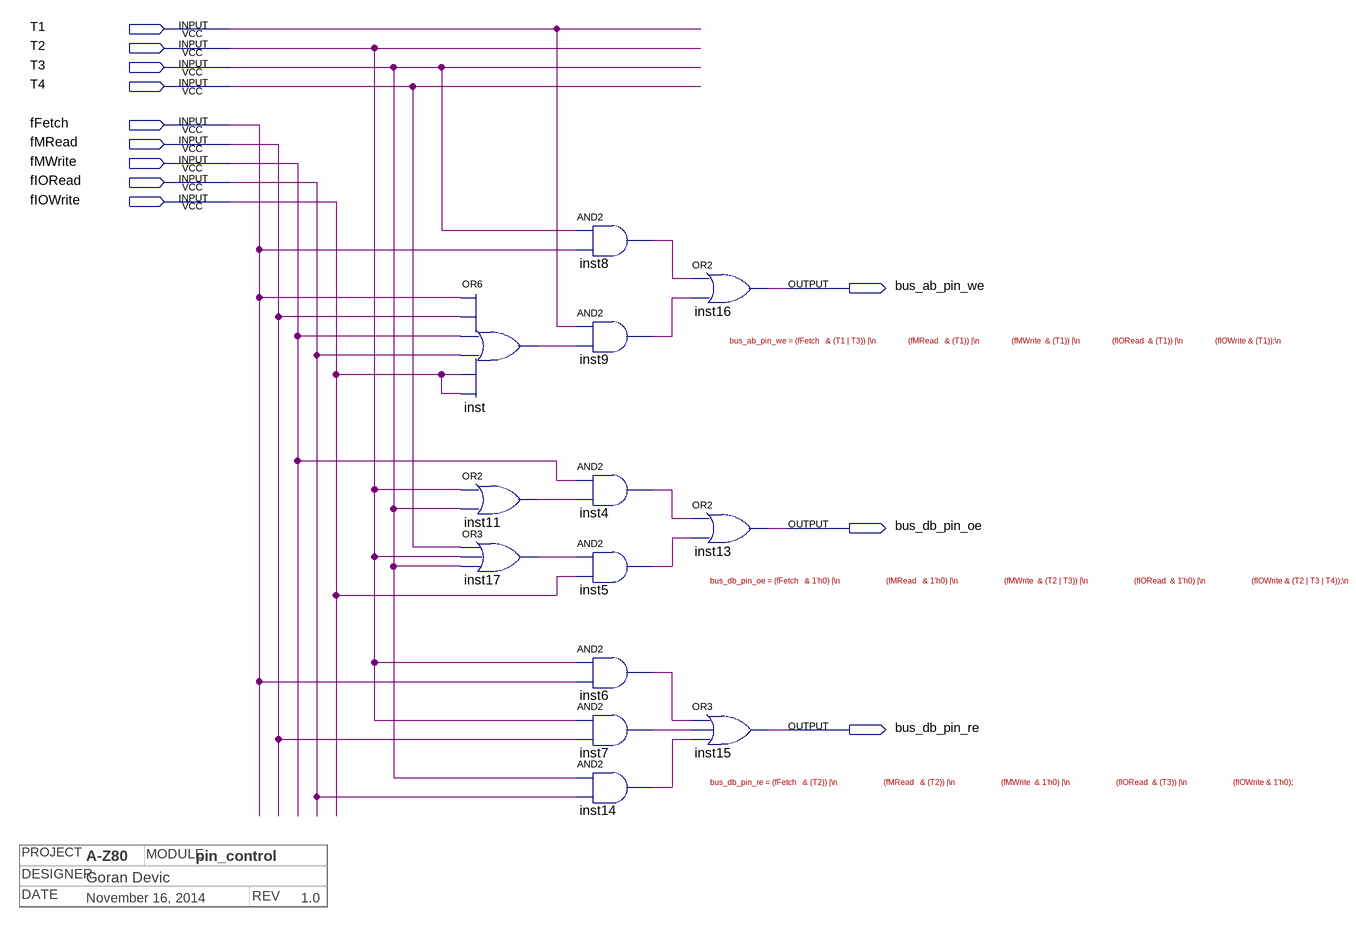
[diagram p0: schematic sheet]
// Quartus schematic pin_control.bdf as structural Verilog: 13 symbols, 12 pins
// Title block: PROJECT: A-Z80; MODULE: pin_control; DESIGNER: Goran Devic; DATE: November 16, 2014; REV: 1.0
module pin_control (
  input  T1,
  input  T2,
  input  T3,
  input  T4,
  input  fFetch,
  input  fMRead,
  input  fMWrite,
  input  fIORead,
  input  fIOWrite,
  output bus_ab_pin_we,
  output bus_db_pin_oe,
  output bus_db_pin_re
);

  wire inst4_out, inst5_out, inst6_out, inst7_out, inst8_out, inst9_out, inst11_out, inst14_out, inst17_out,
       inst_out;

  or inst (inst_out, fFetch, fMRead, fMWrite, fIORead, fIOWrite, fIOWrite);
  or inst11 (inst11_out, T2, T3);
  or inst17 (inst17_out, T4, T2, T3);
  and inst8 (inst8_out, T3, fFetch);
  and inst9 (inst9_out, T1, inst_out);
  and inst4 (inst4_out, fMWrite, inst11_out);
  and inst5 (inst5_out, inst17_out, fIOWrite);
  and inst6 (inst6_out, T2, fFetch);
  and inst7 (inst7_out, T2, fMRead);
  and inst14 (inst14_out, T3, fIORead);
  or inst16 (bus_ab_pin_we, inst8_out, inst9_out);
  or inst13 (bus_db_pin_oe, inst4_out, inst5_out);
  or inst15 (bus_db_pin_re, inst6_out, inst7_out, inst14_out);

  // Notes on the sheet:
  //   bus_ab_pin_we = (fFetch   & (T1 | T3)) |\n                (fMRead   & (T1)) |\n                (fMWrite  & (T1)) |\n                (fIORead  & (T1)) |\n                (fIOWrite & (T1));\n
  //   bus_db_pin_oe = (fFetch   & 1'h0) |\n                       (fMRead   & 1'h0) |\n                       (fMWrite  & (T2 | T3)) |\n                       (fIORead  & 1'h0) |\n                       (fIOWrite & (T2 | T3 | T4));\n
  //   bus_db_pin_re = (fFetch   & (T2)) |\n                       (fMRead   & (T2)) |\n                       (fMWrite  & 1'h0) |\n                       (fIORead  & (T3)) |\n                       (fIOWrite & 1'h0);
endmodule
